# Altium schematic sheet BBB_Board.SchDoc
size C
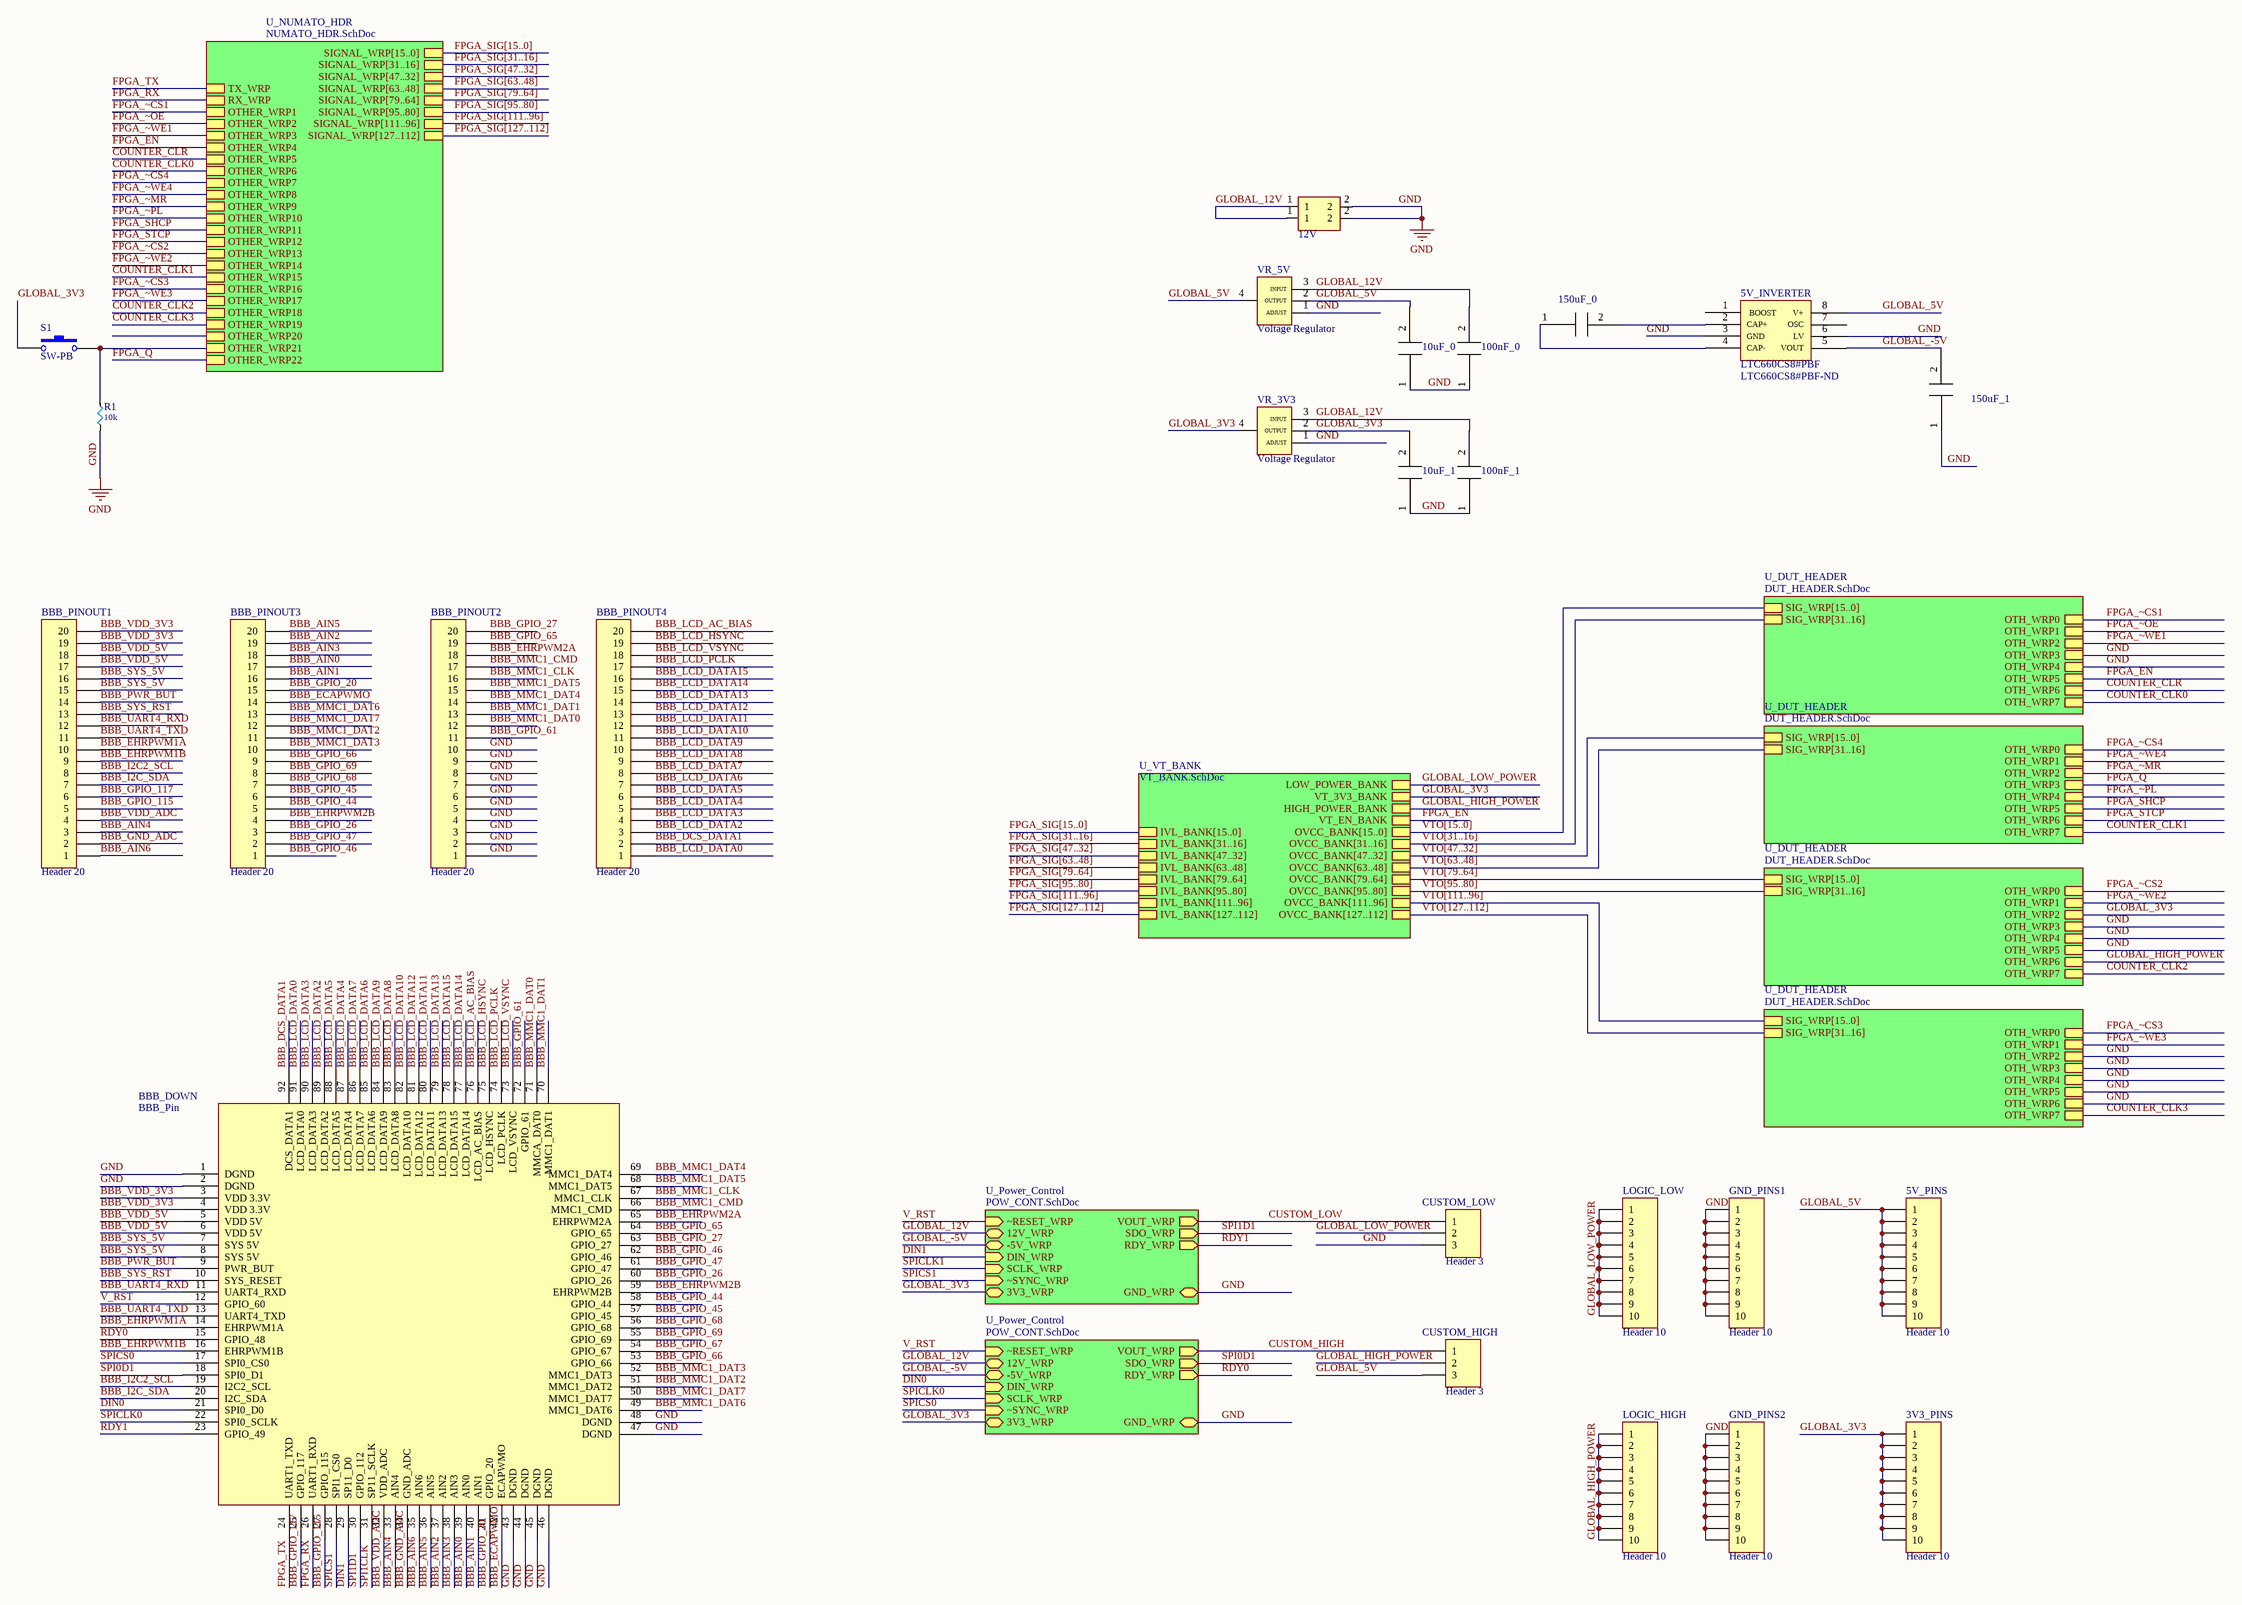
[diagram p0: BBB_Board.SchDoc]

## Parts
3V3_PINS  Header 10  [HDR1X10]
5V_INVERTER  LTC660CS8#PBF  Supplier Part Number 1: LTC660CS8#PBF-ND  [SOIC127P600X175-8N]
5V_PINS  Header 10  [HDR1X10]
10uF_0  0.1uF_0603  [0.1uF_0603]  (value not drawn)
10uF_1  0.1uF_0603  [0.1uF_0603]  (value not drawn)
12V  PJ-002BH-SMT-TR  [CP-002BHPJCT-ND]  (value not drawn)
100nF_0  0.1uF_0603  [0.1uF_0603]  (value not drawn)
100nF_1  0.1uF_0603  [0.1uF_0603]  (value not drawn)
150uF_0  0.1uF_0603  [0.1uF_0603]  (value not drawn)
150uF_1  0.1uF_0603  [0.1uF_0603]  (value not drawn)
BBB_DOWN  BBB_Pin  [BBB_Pin]
BBB_PINOUT1  Header 20  [HDR1X20]
BBB_PINOUT2  Header 20  [HDR1X20]
BBB_PINOUT3  Header 20  [HDR1X20]
BBB_PINOUT4  Header 20  [HDR1X20]
CUSTOM_HIGH  Header 3  [HDR1X3]
CUSTOM_LOW  Header 3  [HDR1X3]
GND_PINS1  Header 10  [HDR1X10]
GND_PINS2  Header 10  [HDR1X10]
LOGIC_HIGH  Header 10  [HDR1X10]
LOGIC_LOW  Header 10  [HDR1X10]
R1  Resistance (Ohms): 10k  [0.1uF_0603]  (hidden comment: RNCS0603BKE10K0)
S1  SW-PB  [SPST-2]
VR_3V3  Voltage Regulator  [volt_reg]
VR_5V  Voltage Regulator  [volt_reg]

## Sub-sheets
U_DUT_HEADER = DUT_HEADER.SchDoc: SIG_WRP[15..0], SIG_WRP[31..16], OTH_WRP0, OTH_WRP1, OTH_WRP2, OTH_WRP3, OTH_WRP4, OTH_WRP5, OTH_WRP6, OTH_WRP7
U_DUT_HEADER = DUT_HEADER.SchDoc: SIG_WRP[15..0], SIG_WRP[31..16], OTH_WRP0, OTH_WRP1, OTH_WRP2, OTH_WRP3, OTH_WRP4, OTH_WRP5, OTH_WRP6, OTH_WRP7
U_DUT_HEADER = DUT_HEADER.SchDoc: SIG_WRP[15..0], SIG_WRP[31..16], OTH_WRP0, OTH_WRP1, OTH_WRP2, OTH_WRP3, OTH_WRP4, OTH_WRP5, OTH_WRP6, OTH_WRP7
U_DUT_HEADER = DUT_HEADER.SchDoc: SIG_WRP[15..0], SIG_WRP[31..16], OTH_WRP0, OTH_WRP1, OTH_WRP2, OTH_WRP3, OTH_WRP4, OTH_WRP5, OTH_WRP6, OTH_WRP7
U_NUMATO_HDR = NUMATO_HDR.SchDoc: SIGNAL_WRP[15..0], SIGNAL_WRP[31..16], SIGNAL_WRP[47..32], SIGNAL_WRP[63..48], SIGNAL_WRP[79..64], SIGNAL_WRP[95..80], SIGNAL_WRP[111..96], SIGNAL_WRP[127..112], OTHER_WRP1, OTHER_WRP2, OTHER_WRP3, OTHER_WRP4, OTHER_WRP5, OTHER_WRP6, OTHER_WRP7, OTHER_WRP8, OTHER_WRP9, OTHER_WRP10, OTHER_WRP11, OTHER_WRP12, OTHER_WRP13, OTHER_WRP14, OTHER_WRP15, OTHER_WRP16, OTHER_WRP17, OTHER_WRP18, OTHER_WRP19, OTHER_WRP20, OTHER_WRP21, OTHER_WRP22, TX_WRP, RX_WRP
U_Power_Control = POW_CONT.SchDoc: ~RESET_WRP, VOUT_WRP, 12V_WRP, -5V_WRP, DIN_WRP, SCLK_WRP, ~SYNC_WRP, SDO_WRP, RDY_WRP, 3V3_WRP, GND_WRP
U_Power_Control = POW_CONT.SchDoc: ~RESET_WRP, VOUT_WRP, 12V_WRP, -5V_WRP, DIN_WRP, SCLK_WRP, ~SYNC_WRP, SDO_WRP, RDY_WRP, 3V3_WRP, GND_WRP
U_VT_BANK = VT_BANK.SchDoc: VT_3V3_BANK, HIGH_POWER_BANK, VT_EN_BANK, OVCC_BANK[15..0], OVCC_BANK[31..16], OVCC_BANK[47..32], OVCC_BANK[63..48], OVCC_BANK[79..64], OVCC_BANK[95..80], OVCC_BANK[111..96], OVCC_BANK[127..112], IVL_BANK[15..0], IVL_BANK[31..16], IVL_BANK[47..32], IVL_BANK[63..48], IVL_BANK[79..64], IVL_BANK[95..80], IVL_BANK[111..96], IVL_BANK[127..112], LOW_POWER_BANK

## Nets
GND: 5V_INVERTER.3(GND) 5V_INVERTER.6(LV) 10uF_0.1 10uF_1.1 12V.2 100nF_0.1 100nF_1.1 150uF_1.1 BBB_DOWN.1(DGND) BBB_DOWN.2(DGND) BBB_DOWN.43(DGND) BBB_DOWN.44(DGND) BBB_DOWN.45(DGND) BBB_DOWN.46(DGND) BBB_DOWN.47(DGND) BBB_DOWN.48(DGND) BBB_PINOUT2.1 BBB_PINOUT2.2 BBB_PINOUT2.3 BBB_PINOUT2.4 BBB_PINOUT2.5 BBB_PINOUT2.6 BBB_PINOUT2.7 BBB_PINOUT2.8 BBB_PINOUT2.9 BBB_PINOUT2.10 CUSTOM_LOW.3 GND_PINS1.1 GND_PINS1.2 GND_PINS1.3 GND_PINS1.4 GND_PINS1.5 GND_PINS1.6 GND_PINS1.7 GND_PINS1.8 GND_PINS1.9 GND_PINS1.10 GND_PINS2.1 GND_PINS2.2 GND_PINS2.3 GND_PINS2.4 GND_PINS2.5 GND_PINS2.6 GND_PINS2.7 GND_PINS2.8 GND_PINS2.9 GND_PINS2.10 R1.1 VR_3V3.1(ADJUST) VR_5V.1(ADJUST) ; sheet U_Power_Control/GND_WRP, sheet U_Power_Control/GND_WRP, sheet U_DUT_HEADER/OTH_WRP3, sheet U_DUT_HEADER/OTH_WRP4, sheet U_DUT_HEADER/OTH_WRP3, sheet U_DUT_HEADER/OTH_WRP4, sheet U_DUT_HEADER/OTH_WRP5, sheet U_DUT_HEADER/OTH_WRP2, sheet U_DUT_HEADER/OTH_WRP3, sheet U_DUT_HEADER/OTH_WRP4, sheet U_DUT_HEADER/OTH_WRP5, sheet U_DUT_HEADER/OTH_WRP6
BBB_AIN0: BBB_DOWN.39(AIN0) BBB_PINOUT3.17
BBB_AIN1: BBB_DOWN.40(AIN1) BBB_PINOUT3.16
BBB_AIN2: BBB_DOWN.37(AIN2) BBB_PINOUT3.19
BBB_AIN3: BBB_DOWN.38(AIN3) BBB_PINOUT3.18
BBB_AIN4: BBB_DOWN.33(AIN4) BBB_PINOUT1.3
BBB_AIN5: BBB_DOWN.36(AIN5) BBB_PINOUT3.20
BBB_AIN6: BBB_DOWN.35(AIN6) BBB_PINOUT1.1
BBB_DCS_DATA1: BBB_DOWN.92(DCS_DATA1) BBB_PINOUT4.2
BBB_ECAPWMO: BBB_DOWN.42(ECAPWMO) BBB_PINOUT3.14
BBB_EHRPWM1A: BBB_DOWN.14(EHRPWM1A) BBB_PINOUT1.10
BBB_EHRPWM1B: BBB_DOWN.16(EHRPWM1B) BBB_PINOUT1.9
BBB_EHRPWM2A: BBB_DOWN.65(EHRPWM2A) BBB_PINOUT2.18
BBB_EHRPWM2B: BBB_DOWN.59(EHRPWM2B) BBB_PINOUT3.4
BBB_GND_ADC: BBB_DOWN.34(GND_ADC) BBB_PINOUT1.2
BBB_GPIO_20: BBB_DOWN.41(GPIO_20) BBB_PINOUT3.15
BBB_GPIO_26: BBB_DOWN.60(GPIO_26) BBB_PINOUT3.3
BBB_GPIO_27: BBB_DOWN.63(GPIO_27) BBB_PINOUT2.20
BBB_GPIO_44: BBB_DOWN.58(GPIO_44) BBB_PINOUT3.5
BBB_GPIO_45: BBB_DOWN.57(GPIO_45) BBB_PINOUT3.6
BBB_GPIO_46: BBB_DOWN.62(GPIO_46) BBB_PINOUT3.1
BBB_GPIO_47: BBB_DOWN.61(GPIO_47) BBB_PINOUT3.2
BBB_GPIO_61: BBB_DOWN.72(GPIO_61) BBB_PINOUT2.11
BBB_GPIO_65: BBB_DOWN.64(GPIO_65) BBB_PINOUT2.19
BBB_GPIO_66: BBB_DOWN.53(GPIO_66) BBB_PINOUT3.9
BBB_GPIO_67: BBB_DOWN.54(GPIO_67)
BBB_GPIO_68: BBB_DOWN.56(GPIO_68) BBB_PINOUT3.7
BBB_GPIO_69: BBB_DOWN.55(GPIO_69) BBB_PINOUT3.8
BBB_GPIO_115: BBB_DOWN.27(GPIO_115) BBB_PINOUT1.5
BBB_GPIO_117: BBB_DOWN.25(GPIO_117) BBB_PINOUT1.6
BBB_I2C2_SCL: BBB_DOWN.19(I2C2_SCL) BBB_PINOUT1.8
BBB_I2C_SDA: BBB_DOWN.20(I2C_SDA) BBB_PINOUT1.7
BBB_LCD_AC_BIAS: BBB_DOWN.76(LCD_AC_BIAS) BBB_PINOUT4.20
BBB_LCD_DATA0: BBB_DOWN.91(LCD_DATA0) BBB_PINOUT4.1
BBB_LCD_DATA2: BBB_DOWN.89(LCD_DATA2) BBB_PINOUT4.3
BBB_LCD_DATA3: BBB_DOWN.90(LCD_DATA3) BBB_PINOUT4.4
BBB_LCD_DATA4: BBB_DOWN.87(LCD_DATA4) BBB_PINOUT4.5
BBB_LCD_DATA5: BBB_DOWN.88(LCD_DATA5) BBB_PINOUT4.6
BBB_LCD_DATA6: BBB_DOWN.85(LCD_DATA6) BBB_PINOUT4.7
BBB_LCD_DATA7: BBB_DOWN.86(LCD_DATA7) BBB_PINOUT4.8
BBB_LCD_DATA8: BBB_DOWN.83(LCD_DATA8) BBB_PINOUT4.9
BBB_LCD_DATA9: BBB_DOWN.84(LCD_DATA9) BBB_PINOUT4.10
BBB_LCD_DATA10: BBB_DOWN.82(LCD_DATA10) BBB_PINOUT4.11
BBB_LCD_DATA11: BBB_DOWN.80(LCD_DATA11) BBB_PINOUT4.12
BBB_LCD_DATA12: BBB_DOWN.81(LCD_DATA12) BBB_PINOUT4.13
BBB_LCD_DATA13: BBB_DOWN.79(LCD_DATA13) BBB_PINOUT4.14
BBB_LCD_DATA14: BBB_DOWN.77(LCD_DATA14) BBB_PINOUT4.15
BBB_LCD_DATA15: BBB_DOWN.78(LCD_DATA15) BBB_PINOUT4.16
BBB_LCD_HSYNC: BBB_DOWN.75(LCD_HSYNC) BBB_PINOUT4.19
BBB_LCD_PCLK: BBB_DOWN.74(LCD_PCLK) BBB_PINOUT4.17
BBB_LCD_VSYNC: BBB_DOWN.73(LCD_VSYNC) BBB_PINOUT4.18
BBB_MMC1_CLK: BBB_DOWN.67(MMC1_CLK) BBB_PINOUT2.16
BBB_MMC1_CMD: BBB_DOWN.66(MMC1_CMD) BBB_PINOUT2.17
BBB_MMC1_DAT0: BBB_DOWN.71(MMCA_DAT0) BBB_PINOUT2.12
BBB_MMC1_DAT1: BBB_DOWN.70(MMC1_DAT1) BBB_PINOUT2.13
BBB_MMC1_DAT2: BBB_DOWN.51(MMC1_DAT2) BBB_PINOUT3.11
BBB_MMC1_DAT3: BBB_DOWN.52(MMC1_DAT3) BBB_PINOUT3.10
BBB_MMC1_DAT4: BBB_DOWN.69(MMC1_DAT4) BBB_PINOUT2.14
BBB_MMC1_DAT5: BBB_DOWN.68(MMC1_DAT5) BBB_PINOUT2.15
BBB_MMC1_DAT6: BBB_DOWN.49(MMC1_DAT6) BBB_PINOUT3.13
BBB_MMC1_DAT7: BBB_DOWN.50(MMC1_DAT7) BBB_PINOUT3.12
BBB_PWR_BUT: BBB_DOWN.9(PWR_BUT) BBB_PINOUT1.14
BBB_SYS_5V: BBB_DOWN.7(SYS_5V) BBB_DOWN.8(SYS_5V) BBB_PINOUT1.15 BBB_PINOUT1.16
BBB_SYS_RST: BBB_DOWN.10(SYS_RESET) BBB_PINOUT1.13
BBB_UART4_RXD: BBB_DOWN.11(UART4_RXD) BBB_PINOUT1.12
BBB_UART4_TXD: BBB_DOWN.13(UART4_TXD) BBB_PINOUT1.11
BBB_VDD_3V3: BBB_DOWN.3(VDD_3.3V) BBB_DOWN.4(VDD_3.3V) BBB_PINOUT1.19 BBB_PINOUT1.20
BBB_VDD_5V: BBB_DOWN.5(VDD_5V) BBB_DOWN.6(VDD_5V) BBB_PINOUT1.17 BBB_PINOUT1.18
BBB_VDD_ADC: BBB_DOWN.32(VDD_ADC) BBB_PINOUT1.4
COUNTER_CLK0: sheet U_DUT_HEADER/OTH_WRP7, sheet U_NUMATO_HDR/OTHER_WRP6
COUNTER_CLK1: sheet U_DUT_HEADER/OTH_WRP7, sheet U_NUMATO_HDR/OTHER_WRP15
COUNTER_CLK2: sheet U_DUT_HEADER/OTH_WRP7, sheet U_NUMATO_HDR/OTHER_WRP18
COUNTER_CLK3: sheet U_DUT_HEADER/OTH_WRP7, sheet U_NUMATO_HDR/OTHER_WRP19
COUNTER_CLR: sheet U_DUT_HEADER/OTH_WRP6, sheet U_NUMATO_HDR/OTHER_WRP5
CUSTOM_HIGH: CUSTOM_HIGH.1 ; sheet U_Power_Control/VOUT_WRP
CUSTOM_LOW: CUSTOM_LOW.1 ; sheet U_Power_Control/VOUT_WRP
DIN0: BBB_DOWN.21(SPI0_D0) ; sheet U_Power_Control/DIN_WRP
DIN1: BBB_DOWN.29(SP11_D0) ; sheet U_Power_Control/DIN_WRP
FPGA_EN: sheet U_VT_BANK/VT_EN_BANK, sheet U_DUT_HEADER/OTH_WRP5, sheet U_NUMATO_HDR/OTHER_WRP4
FPGA_Q: sheet U_DUT_HEADER/OTH_WRP3, sheet U_NUMATO_HDR/OTHER_WRP22
FPGA_RX: BBB_DOWN.26(UART1_RXD) ; sheet U_NUMATO_HDR/RX_WRP
FPGA_SHCP: sheet U_DUT_HEADER/OTH_WRP5, sheet U_NUMATO_HDR/OTHER_WRP11
FPGA_STCP: sheet U_DUT_HEADER/OTH_WRP6, sheet U_NUMATO_HDR/OTHER_WRP12
FPGA_TX: BBB_DOWN.24(UART1_TXD) ; sheet U_NUMATO_HDR/TX_WRP
FPGA_~CS1: sheet U_DUT_HEADER/OTH_WRP0, sheet U_NUMATO_HDR/OTHER_WRP1
FPGA_~CS2: sheet U_DUT_HEADER/OTH_WRP0, sheet U_NUMATO_HDR/OTHER_WRP13
FPGA_~CS3: sheet U_DUT_HEADER/OTH_WRP0, sheet U_NUMATO_HDR/OTHER_WRP16
FPGA_~CS4: sheet U_DUT_HEADER/OTH_WRP0, sheet U_NUMATO_HDR/OTHER_WRP7
FPGA_~MR: sheet U_DUT_HEADER/OTH_WRP2, sheet U_NUMATO_HDR/OTHER_WRP9
FPGA_~OE: sheet U_DUT_HEADER/OTH_WRP1, sheet U_NUMATO_HDR/OTHER_WRP2
FPGA_~PL: sheet U_DUT_HEADER/OTH_WRP4, sheet U_NUMATO_HDR/OTHER_WRP10
FPGA_~WE1: sheet U_DUT_HEADER/OTH_WRP2, sheet U_NUMATO_HDR/OTHER_WRP3
FPGA_~WE2: sheet U_DUT_HEADER/OTH_WRP1, sheet U_NUMATO_HDR/OTHER_WRP14
FPGA_~WE3: sheet U_DUT_HEADER/OTH_WRP1, sheet U_NUMATO_HDR/OTHER_WRP17
FPGA_~WE4: sheet U_DUT_HEADER/OTH_WRP1, sheet U_NUMATO_HDR/OTHER_WRP8
GLOBAL_3V3: 3V3_PINS.1 3V3_PINS.2 3V3_PINS.3 3V3_PINS.4 3V3_PINS.5 3V3_PINS.6 3V3_PINS.7 3V3_PINS.8 3V3_PINS.9 3V3_PINS.10 10uF_1.2 S1.1 VR_3V3.2(OUTPUT) VR_3V3.4(Output) ; sheet U_Power_Control/3V3_WRP, sheet U_Power_Control/3V3_WRP, sheet U_VT_BANK/VT_3V3_BANK, sheet U_DUT_HEADER/OTH_WRP2
GLOBAL_5V: 5V_INVERTER.8(V+) 5V_PINS.1 5V_PINS.2 5V_PINS.3 5V_PINS.4 5V_PINS.5 5V_PINS.6 5V_PINS.7 5V_PINS.8 5V_PINS.9 5V_PINS.10 10uF_0.2 CUSTOM_HIGH.3 VR_5V.2(OUTPUT) VR_5V.4(Output)
GLOBAL_12V: 12V.1 100nF_0.2 100nF_1.2 VR_3V3.3(INPUT) VR_5V.3(INPUT) ; sheet U_Power_Control/12V_WRP, sheet U_Power_Control/12V_WRP
GLOBAL_-5V: 5V_INVERTER.5(VOUT) 150uF_1.2 ; sheet U_Power_Control/-5V_WRP, sheet U_Power_Control/-5V_WRP
GLOBAL_HIGH_POWER: CUSTOM_HIGH.2 LOGIC_HIGH.1 LOGIC_HIGH.2 LOGIC_HIGH.3 LOGIC_HIGH.4 LOGIC_HIGH.5 LOGIC_HIGH.6 LOGIC_HIGH.7 LOGIC_HIGH.8 LOGIC_HIGH.9 LOGIC_HIGH.10 ; sheet U_VT_BANK/HIGH_POWER_BANK, sheet U_DUT_HEADER/OTH_WRP6
GLOBAL_LOW_POWER: CUSTOM_LOW.2 LOGIC_LOW.1 LOGIC_LOW.2 LOGIC_LOW.3 LOGIC_LOW.4 LOGIC_LOW.5 LOGIC_LOW.6 LOGIC_LOW.7 LOGIC_LOW.8 LOGIC_LOW.9 LOGIC_LOW.10 ; sheet U_VT_BANK/LOW_POWER_BANK
RDY0: BBB_DOWN.15(GPIO_48) ; sheet U_Power_Control/RDY_WRP
RDY1: BBB_DOWN.23(GPIO_49) ; sheet U_Power_Control/RDY_WRP
SPI0D1: BBB_DOWN.18(SPI0_D1) ; sheet U_Power_Control/SDO_WRP
SPI1CLK: BBB_DOWN.31(SP11_SCLK)
SPI1D1: BBB_DOWN.30(GPIO_112) ; sheet U_Power_Control/SDO_WRP
SPICLK0: BBB_DOWN.22(SPI0_SCLK) ; sheet U_Power_Control/SCLK_WRP
SPICLK1: sheet U_Power_Control/SCLK_WRP
SPICS0: BBB_DOWN.17(SPI0_CS0) ; sheet U_Power_Control/~SYNC_WRP
SPICS1: BBB_DOWN.28(SPI1_CS0) ; sheet U_Power_Control/~SYNC_WRP
V_RST: BBB_DOWN.12(GPIO_60) ; sheet U_Power_Control/~RESET_WRP, sheet U_Power_Control/~RESET_WRP
Net5V_INVERTER_2: 5V_INVERTER.2(CAP+) 150uF_0.2
Net5V_INVERTER_4: 5V_INVERTER.4(CAP-) 150uF_0.1
NetR1_2: R1.2 S1.2 ; sheet U_NUMATO_HDR/OTHER_WRP21

Not connected (* = marked no-connect by the designer): 5V_INVERTER 1(BOOST) 7(OSC)

## Buses and harness runs
bus FPGA_SIG[15..0] = sheet U_NUMATO_HDR/SIGNAL_WRP[15..0]
bus FPGA_SIG[15..0] = sheet U_VT_BANK/IVL_BANK[15..0]
bus FPGA_SIG[31..16] = sheet U_NUMATO_HDR/SIGNAL_WRP[31..16]
bus FPGA_SIG[31..16] = sheet U_VT_BANK/IVL_BANK[31..16]
bus FPGA_SIG[47..32] = sheet U_NUMATO_HDR/SIGNAL_WRP[47..32]
bus FPGA_SIG[47..32] = sheet U_VT_BANK/IVL_BANK[47..32]
bus FPGA_SIG[63..48] = sheet U_NUMATO_HDR/SIGNAL_WRP[63..48]
bus FPGA_SIG[63..48] = sheet U_VT_BANK/IVL_BANK[63..48]
bus FPGA_SIG[79..64] = sheet U_NUMATO_HDR/SIGNAL_WRP[79..64]
bus FPGA_SIG[79..64] = sheet U_VT_BANK/IVL_BANK[79..64]
bus FPGA_SIG[95..80] = sheet U_NUMATO_HDR/SIGNAL_WRP[95..80]
bus FPGA_SIG[95..80] = sheet U_VT_BANK/IVL_BANK[95..80]
bus FPGA_SIG[111..96] = sheet U_NUMATO_HDR/SIGNAL_WRP[111..96]
bus FPGA_SIG[111..96] = sheet U_VT_BANK/IVL_BANK[111..96]
bus FPGA_SIG[127..112] = sheet U_NUMATO_HDR/SIGNAL_WRP[127..112]
bus FPGA_SIG[127..112] = sheet U_VT_BANK/IVL_BANK[127..112]
bus VTO[15..0] = sheet U_DUT_HEADER/SIG_WRP[15..0] = sheet U_VT_BANK/OVCC_BANK[15..0]
bus VTO[31..16] = sheet U_DUT_HEADER/SIG_WRP[31..16] = sheet U_VT_BANK/OVCC_BANK[31..16]
bus VTO[47..32] = sheet U_DUT_HEADER/SIG_WRP[15..0] = sheet U_VT_BANK/OVCC_BANK[47..32]
bus VTO[63..48] = sheet U_DUT_HEADER/SIG_WRP[31..16] = sheet U_VT_BANK/OVCC_BANK[63..48]
bus VTO[79..64] = sheet U_DUT_HEADER/SIG_WRP[15..0] = sheet U_VT_BANK/OVCC_BANK[79..64]
bus VTO[95..80] = sheet U_DUT_HEADER/SIG_WRP[31..16] = sheet U_VT_BANK/OVCC_BANK[95..80]
bus VTO[111..96] = sheet U_DUT_HEADER/SIG_WRP[15..0] = sheet U_VT_BANK/OVCC_BANK[111..96]
bus VTO[127..112] = sheet U_DUT_HEADER/SIG_WRP[31..16] = sheet U_VT_BANK/OVCC_BANK[127..112]

## Library data of the parts
3V3_PINS 5V_PINS GND_PINS1 GND_PINS2 LOGIC_HIGH LOGIC_LOW = Header 10: Header, 10-Pin; LatestRevisionDate: 17-Jul-2002; LatestRevisionNote: Re-released for DXP Platform.; Publisher: Altium Limited
5V_INVERTER = LTC660CS8#PBF: IC REG SWTCHD CAP INV 0.1A 8SOIC; Manufacturer: Linear Technology; Function: Ratiometric; Output Configuration: Positive or Negative; Topology: Charge Pump; Output Type: Fixed; Number of Outputs: 1; Voltage - Input (Min): 1.5V, 2.5V; Voltage - Input (Max): 5.5V; Voltage - Output (Min/Fixed): -Vin, 2Vin, Vin/2; Current - Output: 100mA; Frequency - Switching: 10kHz, 80kHz; Synchronous Rectifier: No; Supplier 1: Digi-Key; Manufacturer Part Number: LTC660CS8#PBF; RoHS: RoHS Compliant; Category: Integrated Circuits (ICs); Stock 1: 5170; Pricing 1: 1=5.53, 25=3.6704, 100=3.14 (USD); Packaging: Tube; Voltage - Output (Max): -; Operating Temperature: 0°C ~ 70°C (TA); Mounting Type: Surface Mount; Package / Case: 8-SOIC (0.154", 3.90mm Width); Supplier Device Package: 8-SOIC; ComponentLink1URL: http://www.linear.com/docs/1870; ComponentLink1Description: http://www.linear.com/docs/1870
12V = PJ-002BH-SMT-TR: CONN POWER JACK 2.5X5.5MM HI CUR; Manufacturer: CUI Inc; Gender: Male; Plug/Mating Plug Diameter: 2.5mm ID, 5.5mm OD; Number of Positions/Contacts: 2 Conductors, 3 Contacts; Internal Switch(s): Single Switch, Normally Closed; Shielding: Unshielded; Voltage - Rated: 24VDC; Current Rating: 5A; Supplier 1: Digi-Key; Manufacturer Part Number: PJ-002BH-SMT-TR; RoHS: RoHS Compliant; Category: Connectors, Interconnects; Stock 1: 6300; Pricing 1: 350=0.8588, 700=0.8136, 1050=0.7232, 1750=0.6554, 2450=0.60116, 8750=0.5763, 17500=0.565 (USD); Connector Type: Jack; Mounting Type: Surface Mount, Right Angle; Termination: Solder; Features: -; Color: Black; Contact Material: Copper Alloy; Contact Material - Plating: Nickel; Housing Color: Black; Housing Material: Thermoplastic; Operating Temperature: -25°C ~ 85°C; ComponentLink1URL: http://www.cui.com/product/resource/digikeypdf/pj-002bh-smt.pdf; ComponentLink1Description: http://www.cui.com/product/resource/digikeypdf/pj-002bh-smt.pdf; Supplier Part Number 1: CP-002BHPJTR-ND
BBB_PINOUT1-BBB_PINOUT4 = Header 20: Header, 20-Pin; LatestRevisionDate: 17-Jul-2002; LatestRevisionNote: Re-released for DXP Platform.; Publisher: Altium Limited
CUSTOM_HIGH CUSTOM_LOW = Header 3: Header, 3-Pin; LatestRevisionDate: 17-Jul-2002; LatestRevisionNote: Re-released for DXP Platform.; Publisher: Altium Limited
R1 = RNCS0603BKE10K0: RES 10K OHM 1/16W 0.1% 0603; Manufacturer: Stackpole Electronics Inc; Power (Watts): 0.063W, 1/16W; Temperature Coefficient: ±25ppm/°C; Supplier 1: Digi-Key; Manufacturer Part Number: RNCS0603BKE10K0; RoHS: RoHS Compliant; Category: Resistors; Stock 1: 32000; Pricing 1: 1000=0.08, 2000=0.075, 5000=0.0675, 10000=0.066, 25000=0.06375, 50000=0.0625, 100000=0.0619 (USD); Packaging: Tape & Reel (TR); Tolerance: ±0.1%; Composition: Thin Film; Features: Anti-Corrosive, Moisture Resistant; Package / Case: 0603 (1608 Metric); Supplier Device Package: 0603; Size / Dimension: 0.061" L x 0.031" W (1.55mm x 0.80mm); Height: 0.022" (0.55mm); Number of Terminations: 2; ComponentLink1URL: http://www.seielect.com/catalog/SEI-RNCS.pdf; ComponentLink1Description: http://www.seielect.com/catalog/SEI-RNCS.pdf; Supplier Part Number 1: RNCS0603BKE10K0TR-ND
S1 = SW-PB: Switch; Published: 24-Mar-1999; LatestRevisionDate: 17-Jul-2002; LatestRevisionNote: Re-released for DXP Platform.; PackageReference: SPST-2; Publisher: Altium Limited; PackageDescription: Switch; 2 Leads
VR_3V3 VR_5V = Voltage Regulator: IC REG LDO ADJ 1.5A DDPAK; Manufacturer: Texas Instruments; Manufacturer Part Number: LM317KTTR; Regulator Topology: Positive Adjustable; Voltage - Output: 1.25 V ~ 37 V; Number of Regulators: 1; Voltage - Input: 4.2 V ~ 40 V; Supplier 1: Digi-Key; RoHS: RoHS Compliant; Category: Integrated Circuits (ICs); Stock 1: 23750; Pricing 1: 1=0.93, 10=0.816, 100=0.624 (USD); Packaging: Cut Tape (CT); Current - Output: 1.5A; Voltage - Dropout (Typical): -; Current - Limit (Min): -; Operating Temperature: 0°C ~ 125°C; Mounting Type: Surface Mount; Package / Case: TO-263-4, D²Pak (3 Leads + Tab), TO-263AA; Supplier Device Package: DDPAK/TO-263-3; ComponentLink1URL: http://www.ti.com/lit/ds/symlink/lm317.pdf; ComponentLink1Description: http://www.ti.com/lit/ds/symlink/lm317.pdf; Supplier Part Number 1: 296-21390-1-ND